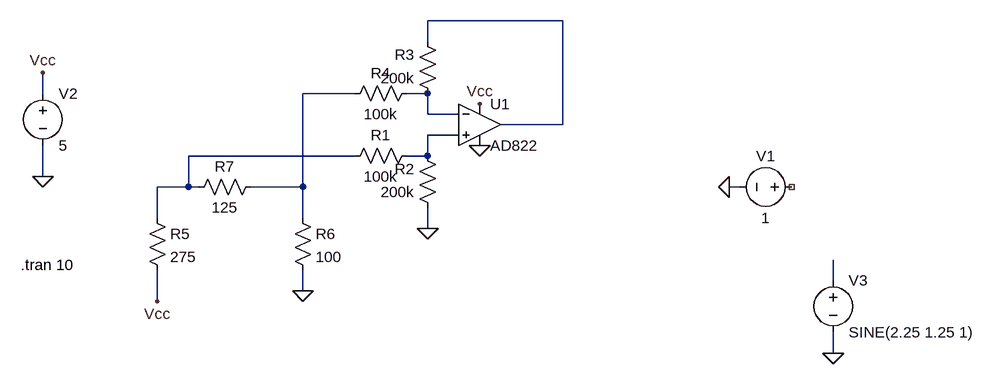
[diagram p0: schematic Offset input impedance effect.asc]
Offset input impedance effect.asc, the LTspice schematic file:
Version 4
SHEET 1 988 680
WIRE 336 0 128 0
WIRE 128 32 128 0
WIRE -464 112 -464 80
WIRE 16 112 -64 112
WIRE 128 112 96 112
WIRE 128 144 128 112
WIRE 176 144 128 144
WIRE 336 160 336 0
WIRE 336 160 240 160
WIRE 176 176 128 176
WIRE 16 208 -240 208
WIRE 128 208 128 176
WIRE 128 208 96 208
WIRE -464 240 -464 192
WIRE -240 256 -240 208
WIRE -240 256 -288 256
WIRE -224 256 -240 256
WIRE -64 256 -64 112
WIRE -64 256 -144 256
WIRE 608 256 592 256
WIRE -288 304 -288 256
WIRE -64 304 -64 256
WIRE 128 320 128 288
WIRE 752 400 752 368
WIRE -64 416 -64 384
WIRE -288 432 -288 384
WIRE 752 512 752 480
FLAG 128 320 0
FLAG 592 256 0
FLAG 208 192 0
FLAG 208 128 Vcc
FLAG -464 80 Vcc
FLAG -464 240 0
FLAG 752 512 0
FLAG -288 432 Vcc
FLAG -64 416 0
SYMBOL Opamps\\AD822 208 96 R0
SYMATTR InstName U1
SYMBOL res 112 192 R90
WINDOW 0 0 56 VBottom 2
WINDOW 3 32 56 VTop 2
SYMATTR InstName R1
SYMATTR Value 100k
SYMBOL res 144 304 R180
WINDOW 0 36 76 Left 2
WINDOW 3 36 40 Left 2
SYMATTR InstName R2
SYMATTR Value 200k
SYMBOL res 144 128 R180
WINDOW 0 36 76 Left 2
WINDOW 3 36 40 Left 2
SYMATTR InstName R3
SYMATTR Value 200k
SYMBOL res 0 128 R270
WINDOW 0 32 56 VTop 2
WINDOW 3 0 56 VBottom 2
SYMATTR InstName R4
SYMATTR Value 100k
SYMBOL voltage 704 256 R90
WINDOW 0 -32 56 VBottom 2
WINDOW 3 32 56 VTop 2
WINDOW 123 0 0 Left 0
WINDOW 39 0 0 Left 0
SYMATTR InstName V1
SYMATTR Value 1
SYMBOL voltage -464 96 R0
WINDOW 123 0 0 Left 0
WINDOW 39 0 0 Left 0
SYMATTR InstName V2
SYMATTR Value 5
SYMBOL voltage 752 384 R0
WINDOW 123 0 0 Left 0
WINDOW 39 0 0 Left 0
SYMATTR InstName V3
SYMATTR Value SINE(2.25 1.25 1)
SYMBOL res -304 288 R0
SYMATTR InstName R5
SYMATTR Value 275
SYMBOL res -80 288 R0
SYMATTR InstName R6
SYMATTR Value 100
SYMBOL res -128 240 R90
WINDOW 0 0 56 VBottom 2
WINDOW 3 32 56 VTop 2
SYMATTR InstName R7
SYMATTR Value 125
TEXT -498 376 Left 2 !.tran 10

The netlist it stands for:
* Offset input impedance effect.asc
XU1 N004 N003 Vcc 0 N001 AD822  ; pins In+ In- V+ V- OUT
R1 N004 N005 100k
R2 0 N004 200k
R3 N003 N001 200k
R4 N002 N003 100k
V1 NC_01 0 1
V2 Vcc 0 5
V3 N006 0 SINE(2.25 1.25 1)
R5 N005 Vcc 275
R6 N002 0 100
R7 N002 N005 125
.tran 10
.backanno
.end